# Altium schematic sheet pwr_brd.SchDoc: Power Board
size A4; Author: Michael McKnight; CompanyName: Pack Bionics; DrawnBy: Michael McKnight; Engineer: Michael McKnight; Organization: Pack Bionics; Revision: 0; SheetNumber: 1; SheetTotal: 1
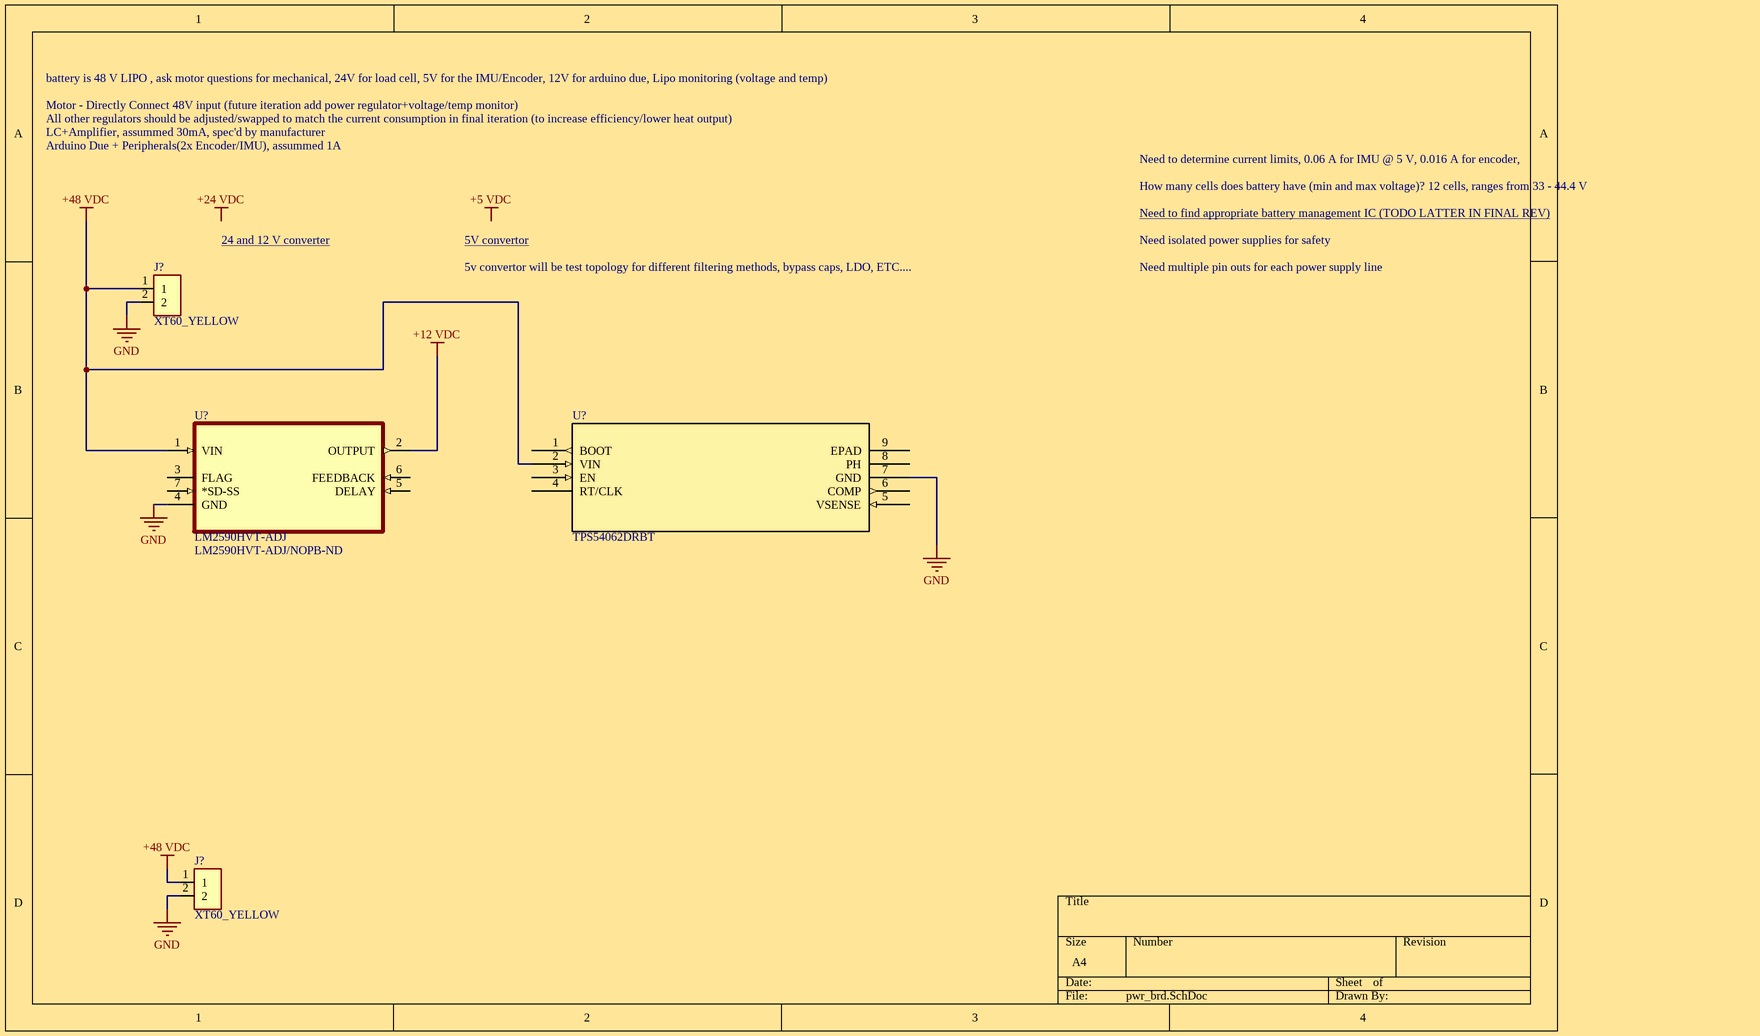
[diagram p0: pwr_brd.SchDoc]

## Parts
(Parts that share a designator on the sheet are numbered #1, #2 ... from top to bottom, then left to right.)
J?#1  XT60_YELLOW  [AMASS_XT60PB-M]
J?#2  XT60_YELLOW  [AMASS_XT60PB-M]
U?#1  TPS54062DRBT  [IC_DRV8601DRBT]
U?#2  LM2590HVT-ADJ  Supplier Part Number 1: LM2590HVT-ADJ/NOPB-ND  [TO127P470X1016X1740-7P]

## Nets
+12 VDC: U?#2.2(OUTPUT)
+48 VDC: J?#1.1 J?#2.1 U?#1.2(VIN) U?#2.1(VIN)
GND: J?#1.2 J?#2.2 U?#1.7(GND) U?#2.4(GND)

Not connected (* = marked no-connect by the designer): U?#1 1(BOOT) 3(EN) 4(RT/CLK) 5(VSENSE) 6(COMP) 8(PH) 9(EPAD); U?#2 3(FLAG) 5(DELAY) 6(FEEDBACK) 7(*SD-SS)

## Notes on the sheet
- battery is 48 V LIPO , ask motor questions for mechanical, 24V for load cell, 5V for the IMU/Encoder, 12V for arduino due, Lipo monitoring (voltage and temp)
- Motor - Directly Connect 48V input (future iteration add power regulator+voltage/temp monitor)
- All other regulators should be adjusted/swapped to match the current consumption in final iteration (to increase efficiency/lower heat output)
- LC+Amplifier, assummed 30mA, spec'd by manufacturer
- Arduino Due + Peripherals(2x Encoder/IMU), assummed 1A
- Need to determine current limits, 0.06 A for IMU @ 5 V, 0.016 A for encoder,
- 24 and 12 V converter <https://www.ti.com/product/LM2590HV?HQS=ti-null-null-verifimanuf_df-manu-pf-octopart-wwe>
- 5V convertor <https://octopart.com/mp2459gj-z-monolithic+power+systems-29216402?r=sp#PriceAndStock>
- How many cells does battery have (min and max voltage)? 12 cells, ranges from 33 - 44.4 V
- Need to find appropriate battery management IC (TODO LATTER IN FINAL REV) <https://www.analog.com/en/products/adbms6830.html#product-overview>
- Need isolated power supplies for safety
- 5v convertor will be test topology for different filtering methods, bypass caps, LDO, ETC....
- Need multiple pin outs for each power supply line
- Labels drawn without touching a wire or pin: +5 VDC, +24 VDC

## Library data of the parts
J?#1 J?#2 = XT60_YELLOW: Power connector; 65A; PIN: 2; Colour: yellow; MP: XT60 YELLOW; MF: Pololu; Package: None; SnapEDA_Link: https://www.snapeda.com/parts/XT60%20YELLOW/Pololu/view-part/423230/?ref=snap; Availability: Unavailable; Price: None; Value: *
U?#1 = TPS54062DRBT: IC REG BUCK ADJUSTABLE 50MA 8SON; Mfr_Name: Texas Instruments; Copyright: Copyright (C) 2022 Ultra Librarian. All rights reserved.; Manufacturer_Part_Number: TPS54062DRBT; Digi-Key_Part_Number_1: 296-30078-1-ND; Digi-Key_Part_Number_2: 296-30078-2-ND; Digi-Key_Part_Number_3: 296-30078-6-ND; Digi-Key_Part_Number_4: 2156-TPS54062DRBT-ND; RefDes: RefDes; Type: DEV
U?#2 = LM2590HVT-ADJ: IC BUCK ADJ 1A; Package: None; Price: None; Value: *; MP: LM2590HVT-ADJ; Availability: Unavailable; Supplier 1: Digi-Key